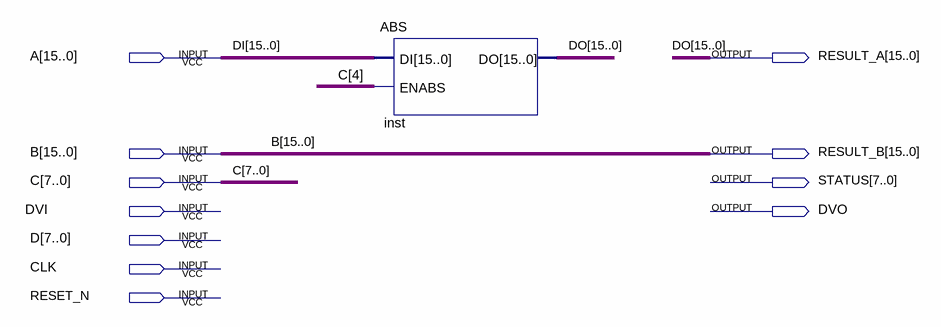
[diagram p0: schematic sheet]
// Quartus schematic StudentDesign.bdf as structural Verilog: 1 symbols, 11 pins
module StudentDesign (
  input  [15:0] A,
  input  [15:0] B,
  input  [7:0] C,
  input  DVI,
  input  [7:0] D,
  input  CLK,
  input  RESET_N,
  output [15:0] RESULT_A,
  output [15:0] RESULT_B,
  output [7:0] STATUS,
  output DVO
);

  ABS inst (.ENABS(C[4]), .DI(A), .DO(RESULT_A));

  assign RESULT_B = B;

  // Other names for the same wires on the sheet: DI[15:0] = A; DO[15:0] = RESULT_A
endmodule
